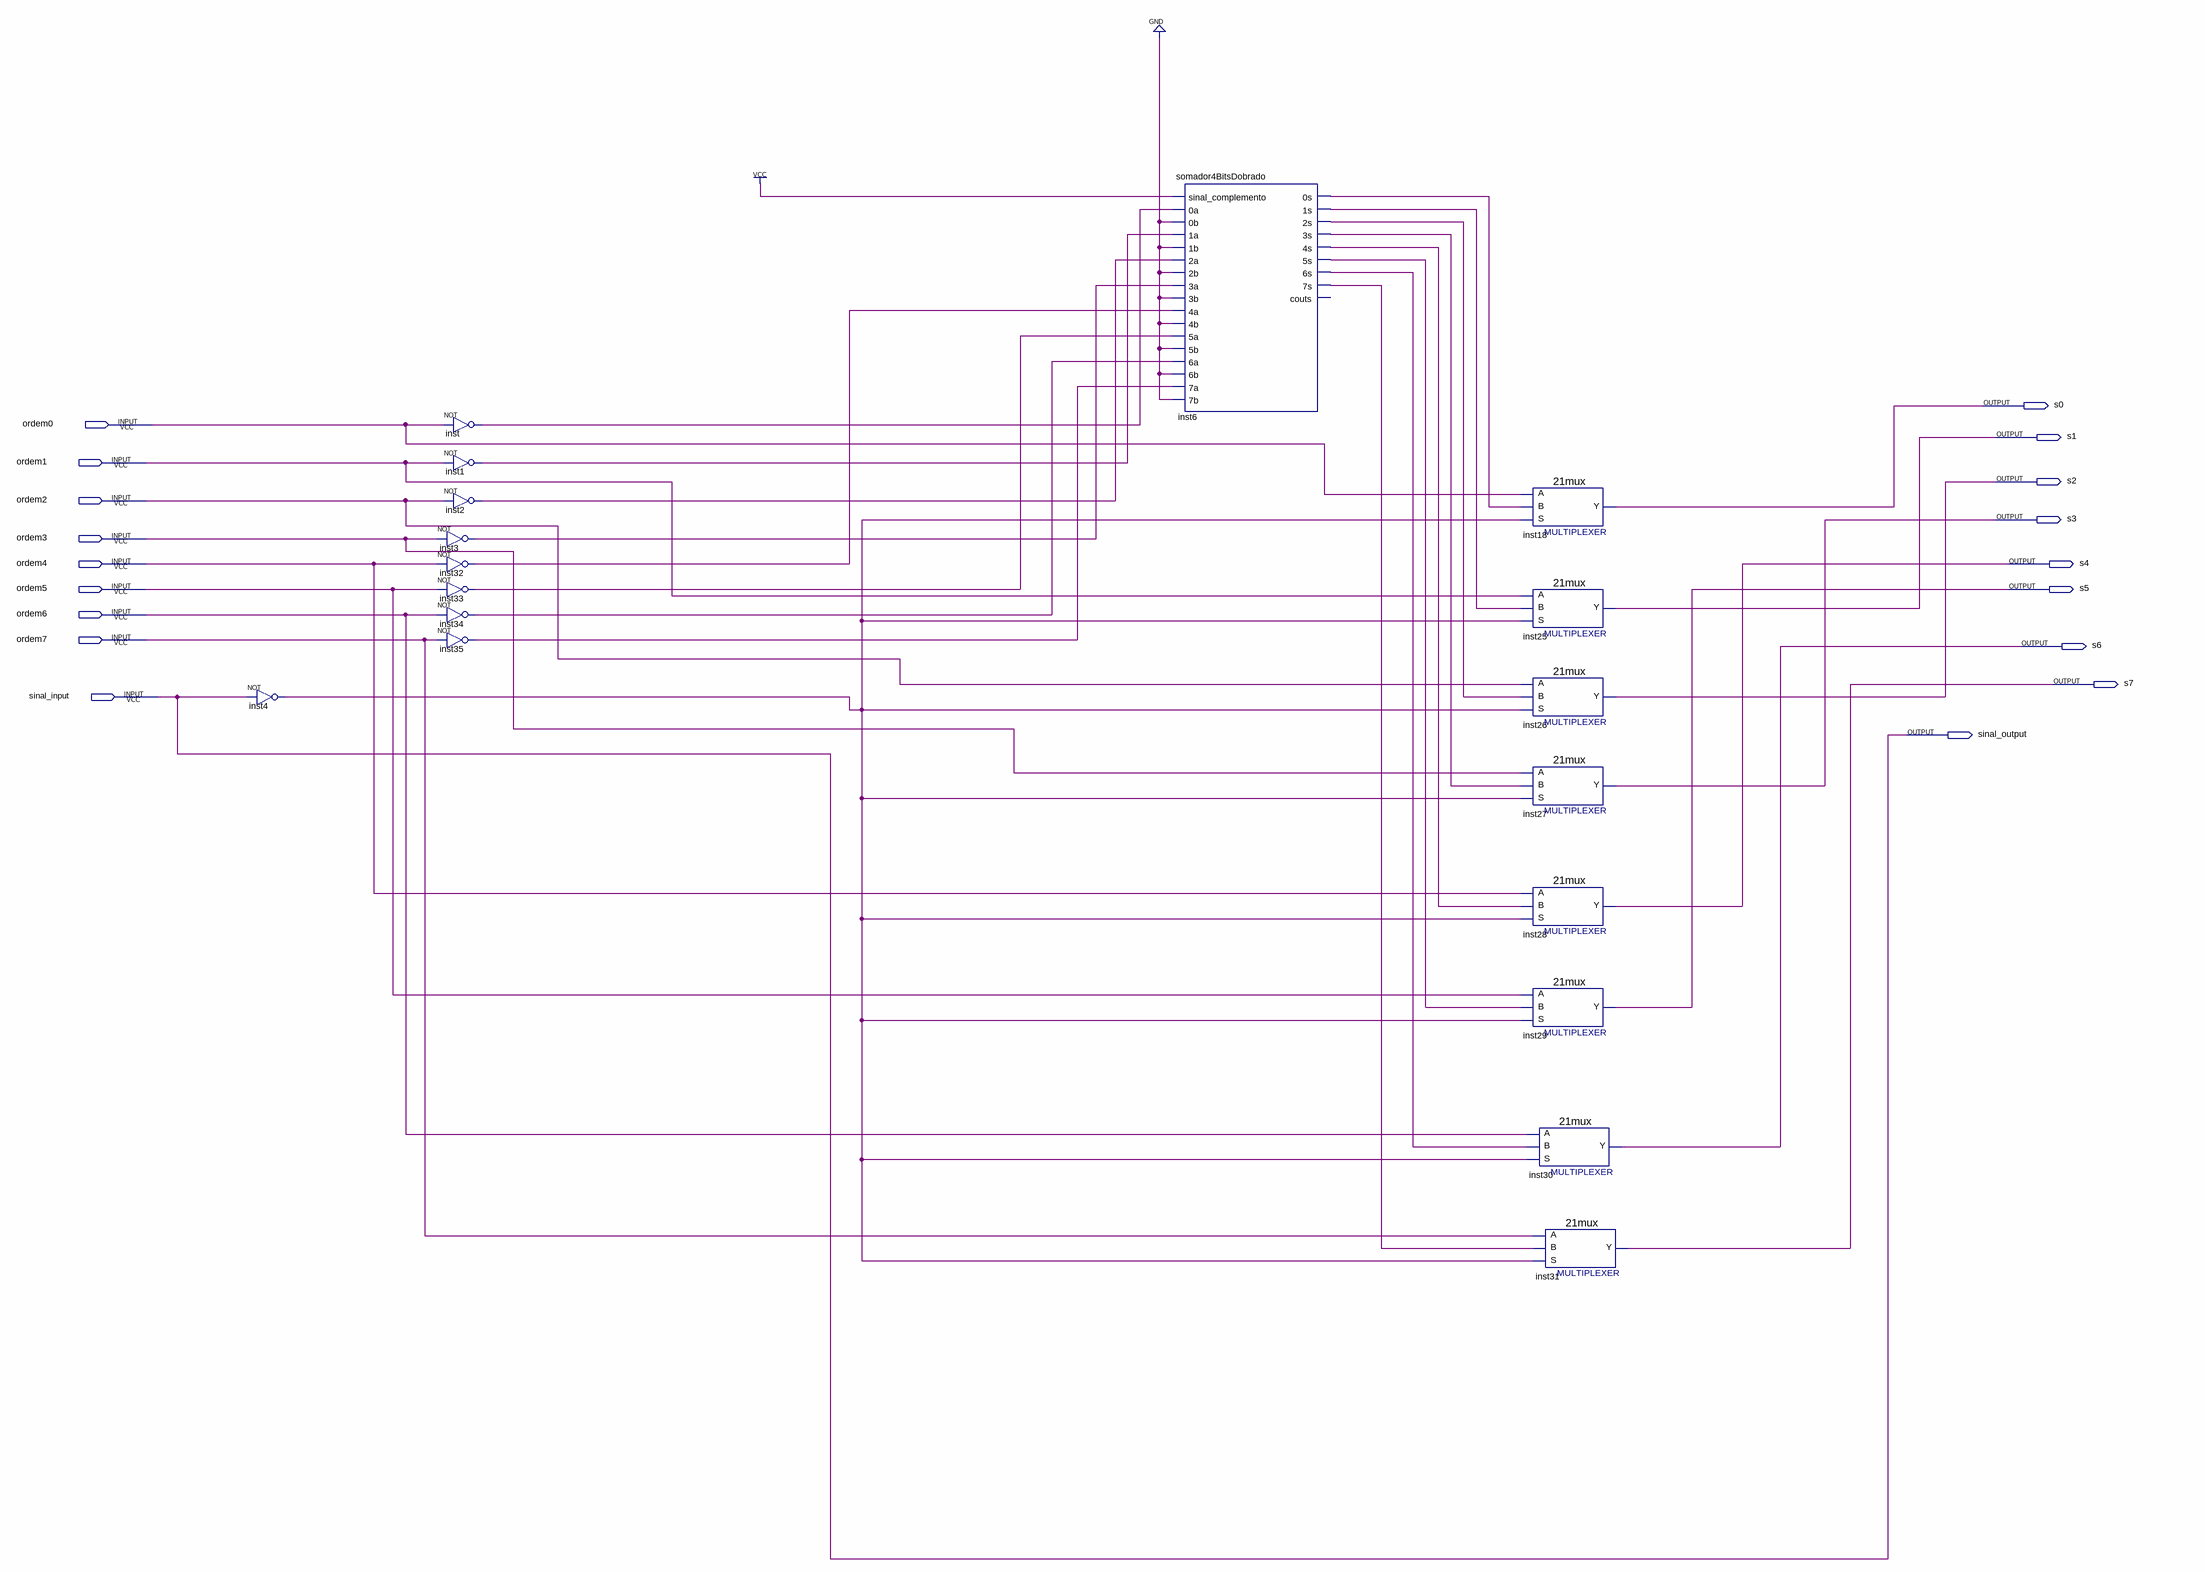
[diagram p0: schematic sheet]
// Quartus schematic complemento2Handler.bdf as structural Verilog: 18 symbols, 18 pins
module complemento2Handler (
  input  ordem0,
  input  ordem1,
  input  ordem2,
  input  ordem3,
  input  ordem4,
  input  ordem5,
  input  ordem6,
  input  ordem7,
  input  sinal_input,
  output s0,
  output s1,
  output s2,
  output s3,
  output s4,
  output s5,
  output s6,
  output s7,
  output sinal_output
);

  wire inst1_out, inst2_out, inst3_out, inst4_out, inst6_0s, inst6_1s, inst6_2s, inst6_3s, inst6_4s,
       inst6_5s, inst6_6s, inst6_7s, inst32_out, inst33_out, inst34_out, inst35_out, inst_out;

  not inst4 (inst4_out, sinal_input);
  not inst (inst_out, ordem0);
  not inst1 (inst1_out, ordem1);
  not inst2 (inst2_out, ordem2);
  not inst3 (inst3_out, ordem3);
  not inst32 (inst32_out, ordem4);
  not inst33 (inst33_out, ordem5);
  not inst34 (inst34_out, ordem6);
  not inst35 (inst35_out, ordem7);
  somador4BitsDobrado inst6 (
    .sinal_complemento(1'b1), .\0a (inst_out), .\0b (1'b0), .\1a (inst1_out), .\1b (1'b0), .\2a (inst2_out),
    .\2b (1'b0), .\3a (inst3_out), .\3b (1'b0), .\4a (inst32_out), .\4b (1'b0), .\5a (inst33_out),
    .\5b (1'b0), .\6a (inst34_out), .\6b (1'b0), .\7a (inst35_out), .\7b (1'b0), .\0s (inst6_0s),
    .\1s (inst6_1s), .\2s (inst6_2s), .\3s (inst6_3s), .\4s (inst6_4s), .\5s (inst6_5s), .\6s (inst6_6s),
    .\7s (inst6_7s));  // open: couts
  \21mux  inst18 (.S(inst4_out), .B(inst6_0s), .A(ordem0), .Y(s0));
  \21mux  inst25 (.S(inst4_out), .B(inst6_1s), .A(ordem1), .Y(s1));
  \21mux  inst26 (.S(inst4_out), .B(inst6_2s), .A(ordem2), .Y(s2));
  \21mux  inst27 (.S(inst4_out), .B(inst6_3s), .A(ordem3), .Y(s3));
  \21mux  inst28 (.S(inst4_out), .B(inst6_4s), .A(ordem4), .Y(s4));
  \21mux  inst29 (.S(inst4_out), .B(inst6_5s), .A(ordem5), .Y(s5));
  \21mux  inst30 (.S(inst4_out), .B(inst6_6s), .A(ordem6), .Y(s6));
  \21mux  inst31 (.S(inst4_out), .B(inst6_7s), .A(ordem7), .Y(s7));

  assign sinal_output = sinal_input;
endmodule
